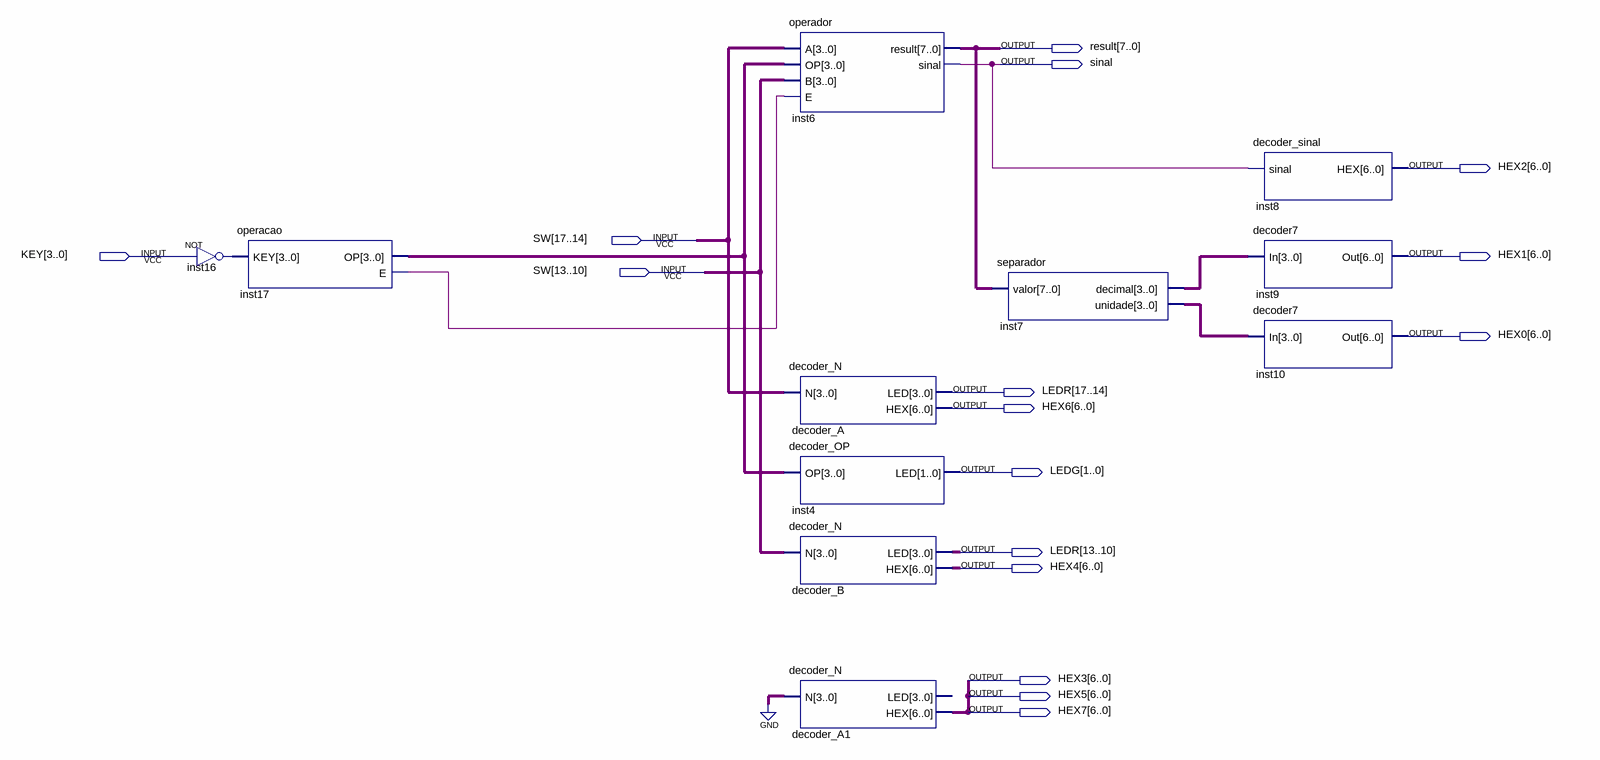
[diagram p0: schematic sheet]
// Quartus schematic teste.bdf as structural Verilog: 11 symbols, 16 pins
module teste (
  input  [17:10] SW,
  input  [3:0] KEY,
  output [7:0] result,
  output sinal,
  output [6:0] HEX2,
  output [6:0] HEX1,
  output [6:0] HEX0,
  output [17:10] LEDR,
  output [6:0] HEX6,
  output [1:0] LEDG,
  output [6:0] HEX4,
  output [6:0] HEX3,
  output [6:0] HEX5,
  output [6:0] HEX7
);

  wire inst17_e;
  wire [3:0] inst7_decimal, inst7_unidade, inst16_out, inst17_op;

  assign inst16_out = ~KEY;  // NOT inst16, 4 bits wide
  operacao inst17 (.KEY(inst16_out), .OP(inst17_op), .E(inst17_e));
  operador inst6 (.A(SW[17:14]), .OP(inst17_op), .B(SW[13:10]), .E(inst17_e), .result(result), .sinal(sinal));
  decoder_N decoder_A (.N(SW[17:14]), .LED(LEDR[17:14]), .HEX(HEX6));
  decoder_OP inst4 (.OP(inst17_op), .LED(LEDG));
  decoder_N decoder_B (.N(SW[13:10]), .LED(LEDR[13:10]), .HEX(HEX4));
  decoder_N decoder_A1 (.N(4'b0000), .HEX(HEX3));  // open: LED
  separador inst7 (.valor(result), .decimal(inst7_decimal), .unidade(inst7_unidade));
  decoder_sinal inst8 (.sinal(sinal), .HEX(HEX2));
  decoder7 inst9 (.In(inst7_decimal), .Out(HEX1));
  decoder7 inst10 (.In(inst7_unidade), .Out(HEX0));

  assign HEX5 = HEX3;
  assign HEX7 = HEX3;
endmodule
